# EAGLE schematic power supply (EAGLE 9.6.2)
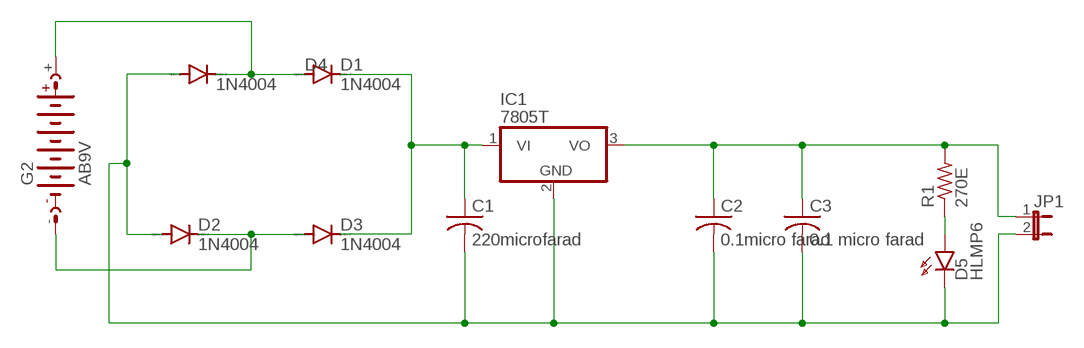
[diagram p0: schematic, sheet 1]

## Parts
C1  220microfarad  C-US050-030X075  [C050-030X075]
C2  0.1micro farad  C-US050-030X075  [C050-030X075]
C3  0.1 micro farad  C-US050-030X075  [C050-030X075]
D1  1N4004  [DO41-10]
D2  1N4004  [DO41-10]
D3  1N4004  [DO41-10]
D4  1N4004  [DO41-10]
D5  HLMP6  [HLMP6]
G2  AB9V  [AB9V]
IC1  7805T  [TO220H]
JP1  JP1E  [JP1]
R1  270E  R-US_0204/7  [0204/7]

## Nets
N$1: D1.A D4.C G2.+
N$2: D2.C D3.A G2.-
N$3: C1.2 C2.2 C3.2 D2.A D4.A D5.K IC1.2(GND) JP1.2
N$4: C1.1 D1.C D3.C IC1.1(VI)
N$5: C2.1 C3.1 IC1.3(VO) JP1.1 R1.2
N$6: D5.A R1.1

## Library data of the parts
C1-C3 = adafruit:C-US: CAPACITOR, American symbol
D1-D4 = diode:1N4004: DIODE general purpose rectifier, 1 A
D5 = display-hp:HLMP6: LED 2mm horizontal; MF: AGILENT TECHNOLOGIES; MPN: HLMP-6500; OC_FARNELL: 1652490; OC_NEWARK: 40K0088
G2 = battery:AB9V: 9-V BATTERY CLIP
IC1 = linear:78*: Positive VOLTAGE REGULATOR Source: http://cache.national.com/ds/LM/LM78L05.pdf http://www.fairchildsemi.com/ds/LM/LM7805.pdf
JP1 = jumper:JP1E: JUMPER
R1 = rcl:R-US_: RESISTOR, American symbol; SPICEPREFIX: R